# Altium schematic sheet develboard.SchDoc
size A3; License: GPLv3; Hw_rev: 0; Address3: Firenze; Address4: ITALY; DocumentNumber: 3; Revision: 0; SheetNumber: 3; SheetTotal: 8
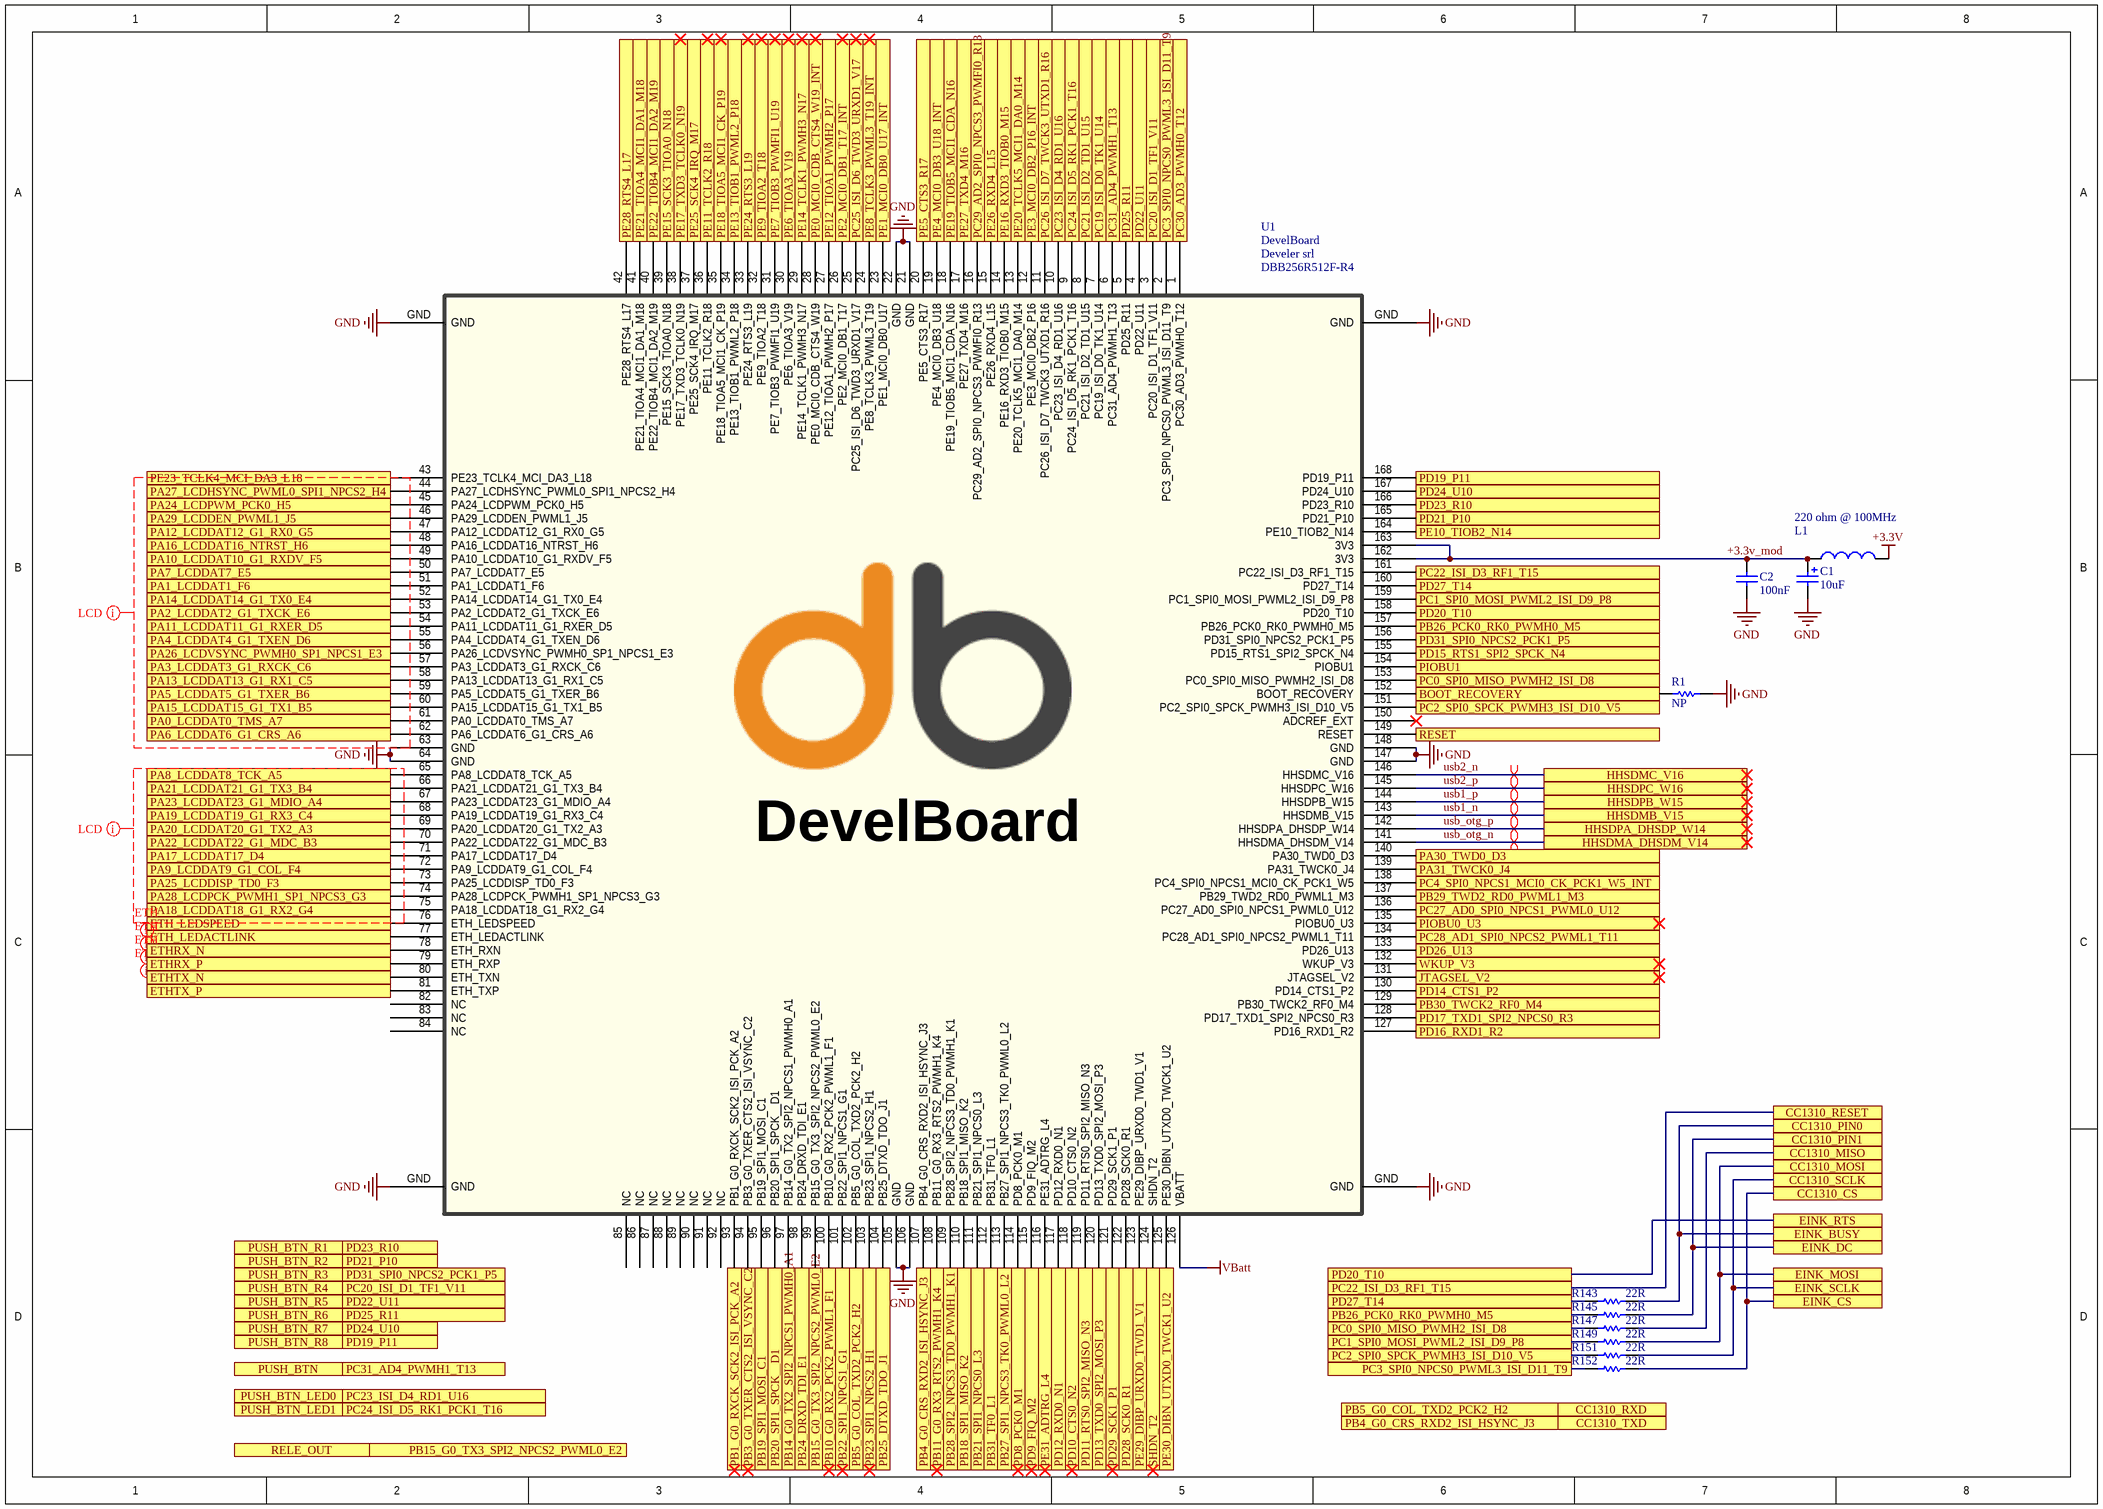
[diagram p0: develboard.SchDoc]

## Parts
C1  10uF  [1206_[3216]]
C2  100nF  [0603_[1608]]
L1  220 ohm @ 100MHz  [0805_[2012]]
R1  NP  [0603_[1608]]
R143  22R  [0603_[1608]]
R145  22R  [0603_[1608]]
R147  22R  [0603_[1608]]
R149  22R  [0603_[1608]]
R151  22R  [0603_[1608]]
R152  22R  [0603_[1608]]
U1  DevelBoard  Company: Develer srl  Order Code: DBB256R512F-R4  [develboard_footprint]

## Ports
BOOT_RECOVERY, CC1310_CS, CC1310_MISO, CC1310_MOSI, CC1310_PIN0, CC1310_PIN1, CC1310_RESET, CC1310_RXD, CC1310_SCLK, CC1310_TXD, EINK_BUSY, EINK_CS, EINK_DC, EINK_MOSI, EINK_RTS, EINK_SCLK, ETH_LEDACTLINK, ETH_LEDSPEED, ETHRX_N, ETHRX_P, ETHTX_N, ETHTX_P, HHSDMA_DHSDM_V14, HHSDMB_V15, HHSDMC_V16, HHSDPA_DHSDP_W14, HHSDPB_W15, HHSDPC_W16, JTAGSEL_V2, PA0_LCDDAT0_TMS_A7, PA1_LCDDAT1_F6, PA2_LCDDAT2_G1_TXCK_E6, PA3_LCDDAT3_G1_RXCK_C6, PA4_LCDDAT4_G1_TXEN_D6, PA5_LCDDAT5_G1_TXER_B6, PA6_LCDDAT6_G1_CRS_A6, PA7_LCDDAT7_E5, PA8_LCDDAT8_TCK_A5, PA9_LCDDAT9_G1_COL_F4, PA10_LCDDAT10_G1_RXDV_F5, PA11_LCDDAT11_G1_RXER_D5, PA12_LCDDAT12_G1_RX0_G5, PA13_LCDDAT13_G1_RX1_C5, PA14_LCDDAT14_G1_TX0_E4, PA15_LCDDAT15_G1_TX1_B5, PA16_LCDDAT16_NTRST_H6, PA17_LCDDAT17_D4, PA18_LCDDAT18_G1_RX2_G4, PA19_LCDDAT19_G1_RX3_C4, PA20_LCDDAT20_G1_TX2_A3, PA21_LCDDAT21_G1_TX3_B4, PA22_LCDDAT22_G1_MDC_B3, PA23_LCDDAT23_G1_MDIO_A4, PA24_LCDPWM_PCK0_H5, PA25_LCDDISP_TD0_F3, PA26_LCDVSYNC_PWMH0_SP1_NPCS1_E3, PA27_LCDHSYNC_PWML0_SPI1_NPCS2_H4, PA28_LCDPCK_PWMH1_SP1_NPCS3_G3, PA29_LCDDEN_PWML1_J5, PA30_TWD0_D3, PA31_TWCK0_J4, PB1_G0_RXCK_SCK2_ISI_PCK_A2, PB3_G0_TXER_CTS2_ISI_VSYNC_C2, PB4_G0_CRS_RXD2_ISI_HSYNC_J3, PB5_G0_COL_TXD2_PCK2_H2, PB10_G0_RX2_PCK2_PWML1_F1, PB11_G0_RX3_RTS2_PWMH1_K4, PB14_G0_TX2_SPI2_NPCS1_PWMH0_A1, PB15_G0_TX3_SPI2_NPCS2_PWML0_E2, PB18_SPI1_MISO_K2, PB19_SPI1_MOSI_C1, PB20_SPI1_SPCK__D1, PB21_SPI1_NPCS0_L3, PB22_SPI1_NPCS1_G1, PB23_SPI1_NPCS2_H1, PB24_DRXD_TDI_E1, PB25_DTXD_TDO_J1, PB26_PCK0_RK0_PWMH0_M5, PB27_SPI1_NPCS3_TK0_PWML0_L2, PB28_SPI2_NPCS3_TD0_PWMH1_K1, PB29_TWD2_RD0_PWML1_M3, PB30_TWCK2_RF0_M4, PB31_TF0_L1, PC0_SPI0_MISO_PWMH2_ISI_D8, PC1_SPI0_MOSI_PWML2_ISI_D9_P8, PC2_SPI0_SPCK_PWMH3_ISI_D10_V5, PC3_SPI0_NPCS0_PWML3_ISI_D11_T9, PC4_SPI0_NPCS1_MCI0_CK_PCK1_W5_INT, PC19_ISI_D0_TK1_U14, PC20_ISI_D1_TF1_V11, PC21_ISI_D2_TD1_U15, PC22_ISI_D3_RF1_T15, PC23_ISI_D4_RD1_U16, PC24_ISI_D5_RK1_PCK1_T16, PC25_ISI_D6_TWD3_URXD1_V17, PC26_ISI_D7_TWCK3_UTXD1_R16, PC27_AD0_SPI0_NPCS1_PWML0_U12, PC28_AD1_SPI0_NPCS2_PWML1_T11, PC29_AD2_SPI0_NPCS3_PWMFI0_R13, PC30_AD3_PWMH0_T12, PC31_AD4_PWMH1_T13, PD8_PCK0_M1, PD9_FIQ_M2, PD10_CTS0_N2, PD11_RTS0_SPI2_MISO_N3, PD12_RXD0_N1, PD13_TXD0_SPI2_MOSI_P3, PD14_CTS1_P2, PD15_RTS1_SPI2_SPCK_N4, PD16_RXD1_R2, PD17_TXD1_SPI2_NPCS0_R3, PD19_P11, PD20_T10, PD21_P10, PD22_U11, PD23_R10, PD24_U10, PD25_R11, PD26_U13, PD27_T14, PD28_SCK0_R1, PD29_SCK1_P1, PD31_SPI0_NPCS2_PCK1_P5, PE0_MCI0_CDB_CTS4_W19_INT, PE1_MCI0_DB0_U17_INT, PE2_MCI0_DB1_T17_INT, PE3_MCI0_DB2_P16_INT, PE4_MCI0_DB3_U18_INT, PE5_CTS3_R17, PE6_TIOA3_V19, PE7_TIOB3_PWMFI1_U19, PE8_TCLK3_PWML3_T19_INT, PE9_TIOA2_T18, PE10_TIOB2_N14, PE11_TCLK2_R18, PE12_TIOA1_PWMH2_P17, PE13_TIOB1_PWML2_P18, PE14_TCLK1_PWMH3_N17, PE15_SCK3_TIOA0_N18, PE16_RXD3_TIOB0_M15, PE17_TXD3_TCLK0_N19, PE18_TIOA5_MCI1_CK_P19, PE19_TIOB5_MCI1_CDA_N16, PE20_TCLK5_MCI1_DA0_M14, PE21_TIOA4_MCI1_DA1_M18, PE22_TIOB4_MCI1_DA2_M19, PE23_TCLK4_MCI_DA3_L18, PE24_RTS3_L19, PE25_SCK4_IRQ_M17, PE26_RXD4_L15, PE27_TXD4_M16, PE28_RTS4_L17, PE29_DIBP_URXD0_TWD1_V1, PE30_DIBN_UTXD0_TWCK1_U2, PE31_ADTRG_L4, PIOBU0_U3, PIOBU1, PUSH_BTN, PUSH_BTN_LED0, PUSH_BTN_LED1, PUSH_BTN_R1, PUSH_BTN_R2, PUSH_BTN_R3, PUSH_BTN_R4, PUSH_BTN_R5, PUSH_BTN_R6, PUSH_BTN_R7, PUSH_BTN_R8, RELE_OUT, RESET, SHDN_T2, WKUP_V3

## Nets
+3.3V: L1.1
GND: C1.2 C2.2 R1.1 U1.21(GND) U1.22(GND) U1.63(GND) U1.64(GND) U1.105(GND) U1.106(GND) U1.147(GND) U1.148(GND) U1.GND
VBatt: U1.126(VBATT)
+3.3v_mod: C1.1 C2.1 L1.2 U1.162(3V3) U1.163(3V3)
BOOT_RECOVERY: R1.2 U1.152(BOOT_RECOVERY) ; port BOOT_RECOVERY
CC1310_CS: R152.1 ; port CC1310_CS, port EINK_CS
CC1310_MISO: R147.1 ; port CC1310_MISO
CC1310_MOSI: R149.1 ; port CC1310_MOSI, port EINK_MOSI
CC1310_PIN0: R143.1 ; port CC1310_PIN0, port EINK_BUSY
CC1310_PIN1: R145.1 ; port CC1310_PIN1, port EINK_DC
CC1310_RESET: U1.161(PC22_ISI_D3_RF1_T15) ; port PC22_ISI_D3_RF1_T15, port CC1310_RESET
CC1310_RXD: U1.102(PB5_G0_COL_TXD2_PCK2_H2) ; port PB5_G0_COL_TXD2_PCK2_H2, port CC1310_RXD
CC1310_SCLK: R151.1 ; port CC1310_SCLK, port EINK_SCLK
CC1310_TXD: U1.107(PB4_G0_CRS_RXD2_ISI_HSYNC_J3) ; port PB4_G0_CRS_RXD2_ISI_HSYNC_J3, port CC1310_TXD
EINK_RTS: U1.158(PD20_T10) ; port PD20_T10, port EINK_RTS
ETH_LEDACTLINK: U1.77(ETH_LEDACTLINK) ; port ETH_LEDACTLINK
ETH_LEDSPEED: U1.76(ETH_LEDSPEED) ; port ETH_LEDSPEED
ETHRX_N: U1.78(ETH_RXN) ; port ETHRX_N
ETHRX_P: U1.79(ETH_RXP) ; port ETHRX_P
ETHTX_N: U1.80(ETH_TXN) ; port ETHTX_N
ETHTX_P: U1.81(ETH_TXP) ; port ETHTX_P
JTAGSEL_V2: U1.131(JTAGSEL_V2) ; port JTAGSEL_V2
PA0_LCDDAT0_TMS_A7: U1.61(PA0_LCDDAT0_TMS_A7) ; port PA0_LCDDAT0_TMS_A7
PA1_LCDDAT1_F6: U1.51(PA1_LCDDAT1_F6) ; port PA1_LCDDAT1_F6
PA2_LCDDAT2_G1_TXCK_E6: U1.53(PA2_LCDDAT2_G1_TXCK_E6) ; port PA2_LCDDAT2_G1_TXCK_E6
PA3_LCDDAT3_G1_RXCK_C6: U1.57(PA3_LCDDAT3_G1_RXCK_C6) ; port PA3_LCDDAT3_G1_RXCK_C6
PA4_LCDDAT4_G1_TXEN_D6: U1.55(PA4_LCDDAT4_G1_TXEN_D6) ; port PA4_LCDDAT4_G1_TXEN_D6
PA5_LCDDAT5_G1_TXER_B6: U1.59(PA5_LCDDAT5_G1_TXER_B6) ; port PA5_LCDDAT5_G1_TXER_B6
PA6_LCDDAT6_G1_CRS_A6: U1.62(PA6_LCDDAT6_G1_CRS_A6) ; port PA6_LCDDAT6_G1_CRS_A6
PA7_LCDDAT7_E5: U1.50(PA7_LCDDAT7_E5) ; port PA7_LCDDAT7_E5
PA8_LCDDAT8_TCK_A5: U1.65(PA8_LCDDAT8_TCK_A5) ; port PA8_LCDDAT8_TCK_A5
PA9_LCDDAT9_G1_COL_F4: U1.72(PA9_LCDDAT9_G1_COL_F4) ; port PA9_LCDDAT9_G1_COL_F4
PA10_LCDDAT10_G1_RXDV_F5: U1.49(PA10_LCDDAT10_G1_RXDV_F5) ; port PA10_LCDDAT10_G1_RXDV_F5
PA11_LCDDAT11_G1_RXER_D5: U1.54(PA11_LCDDAT11_G1_RXER_D5) ; port PA11_LCDDAT11_G1_RXER_D5
PA12_LCDDAT12_G1_RX0_G5: U1.47(PA12_LCDDAT12_G1_RX0_G5) ; port PA12_LCDDAT12_G1_RX0_G5
PA13_LCDDAT13_G1_RX1_C5: U1.58(PA13_LCDDAT13_G1_RX1_C5) ; port PA13_LCDDAT13_G1_RX1_C5
PA14_LCDDAT14_G1_TX0_E4: U1.52(PA14_LCDDAT14_G1_TX0_E4) ; port PA14_LCDDAT14_G1_TX0_E4
PA15_LCDDAT15_G1_TX1_B5: U1.60(PA15_LCDDAT15_G1_TX1_B5) ; port PA15_LCDDAT15_G1_TX1_B5
PA16_LCDDAT16_NTRST_H6: U1.48(PA16_LCDDAT16_NTRST_H6) ; port PA16_LCDDAT16_NTRST_H6
PA17_LCDDAT17_D4: U1.71(PA17_LCDDAT17_D4) ; port PA17_LCDDAT17_D4
PA18_LCDDAT18_G1_RX2_G4: U1.75(PA18_LCDDAT18_G1_RX2_G4) ; port PA18_LCDDAT18_G1_RX2_G4
PA19_LCDDAT19_G1_RX3_C4: U1.68(PA19_LCDDAT19_G1_RX3_C4) ; port PA19_LCDDAT19_G1_RX3_C4
PA20_LCDDAT20_G1_TX2_A3: U1.69(PA20_LCDDAT20_G1_TX2_A3) ; port PA20_LCDDAT20_G1_TX2_A3
PA21_LCDDAT21_G1_TX3_B4: U1.66(PA21_LCDDAT21_G1_TX3_B4) ; port PA21_LCDDAT21_G1_TX3_B4
PA22_LCDDAT22_G1_MDC_B3: U1.70(PA22_LCDDAT22_G1_MDC_B3) ; port PA22_LCDDAT22_G1_MDC_B3
PA23_LCDDAT23_G1_MDIO_A4: U1.67(PA23_LCDDAT23_G1_MDIO_A4) ; port PA23_LCDDAT23_G1_MDIO_A4
PA24_LCDPWM_PCK0_H5: U1.45(PA24_LCDPWM_PCK0_H5) ; port PA24_LCDPWM_PCK0_H5
PA25_LCDDISP_TD0_F3: U1.73(PA25_LCDDISP_TD0_F3) ; port PA25_LCDDISP_TD0_F3
PA26_LCDVSYNC_PWMH0_SP1_NPCS1_E3: U1.56(PA26_LCDVSYNC_PWMH0_SP1_NPCS1_E3) ; port PA26_LCDVSYNC_PWMH0_SP1_NPCS1_E3
PA27_LCDHSYNC_PWML0_SPI1_NPCS2_H4: U1.44(PA27_LCDHSYNC_PWML0_SPI1_NPCS2_H4) ; port PA27_LCDHSYNC_PWML0_SPI1_NPCS2_H4
PA28_LCDPCK_PWMH1_SP1_NPCS3_G3: U1.74(PA28_LCDPCK_PWMH1_SP1_NPCS3_G3) ; port PA28_LCDPCK_PWMH1_SP1_NPCS3_G3
PA29_LCDDEN_PWML1_J5: U1.46(PA29_LCDDEN_PWML1_J5) ; port PA29_LCDDEN_PWML1_J5
PA30_TWD0_D3: U1.140(PA30_TWD0_D3) ; port PA30_TWD0_D3
PA31_TWCK0_J4: U1.139(PA31_TWCK0_J4) ; port PA31_TWCK0_J4
PB1_G0_RXCK_SCK2_ISI_PCK_A2: U1.93(PB1_G0_RXCK_SCK2_ISI_PCK_A2) ; port PB1_G0_RXCK_SCK2_ISI_PCK_A2
PB3_G0_TXER_CTS2_ISI_VSYNC_C2: U1.94(PB3_G0_TXER_CTS2_ISI_VSYNC_C2) ; port PB3_G0_TXER_CTS2_ISI_VSYNC_C2
PB10_G0_RX2_PCK2_PWML1_F1: U1.100(PB10_G0_RX2_PCK2_PWML1_F1) ; port PB10_G0_RX2_PCK2_PWML1_F1
PB11_G0_RX3_RTS2_PWMH1_K4: U1.108(PB11_G0_RX3_RTS2_PWMH1_K4) ; port PB11_G0_RX3_RTS2_PWMH1_K4
PB14_G0_TX2_SPI2_NPCS1_PWMH0_A1: U1.97(PB14_G0_TX2_SPI2_NPCS1_PWMH0_A1) ; port PB14_G0_TX2_SPI2_NPCS1_PWMH0_A1
PB15_G0_TX3_SPI2_NPCS2_PWML0_E2: U1.99(PB15_G0_TX3_SPI2_NPCS2_PWML0_E2) ; port PB15_G0_TX3_SPI2_NPCS2_PWML0_E2, port RELE_OUT
PB18_SPI1_MISO_K2: U1.110(PB18_SPI1_MISO_K2) ; port PB18_SPI1_MISO_K2
PB19_SPI1_MOSI_C1: U1.95(PB19_SPI1_MOSI_C1) ; port PB19_SPI1_MOSI_C1
PB20_SPI1_SPCK__D1: U1.96(PB20_SPI1_SPCK__D1) ; port PB20_SPI1_SPCK__D1
PB21_SPI1_NPCS0_L3: U1.111(PB21_SPI1_NPCS0_L3) ; port PB21_SPI1_NPCS0_L3
PB22_SPI1_NPCS1_G1: U1.101(PB22_SPI1_NPCS1_G1) ; port PB22_SPI1_NPCS1_G1
PB23_SPI1_NPCS2_H1: U1.103(PB23_SPI1_NPCS2_H1) ; port PB23_SPI1_NPCS2_H1
PB24_DRXD_TDI_E1: U1.98(PB24_DRXD_TDI_E1) ; port PB24_DRXD_TDI_E1
PB25_DTXD_TDO_J1: U1.104(PB25_DTXD_TDO_J1) ; port PB25_DTXD_TDO_J1
PB26_PCK0_RK0_PWMH0_M5: R145.2 U1.157(PB26_PCK0_RK0_PWMH0_M5) ; port PB26_PCK0_RK0_PWMH0_M5
PB27_SPI1_NPCS3_TK0_PWML0_L2: U1.113(PB27_SPI1_NPCS3_TK0_PWML0_L2) ; port PB27_SPI1_NPCS3_TK0_PWML0_L2
PB28_SPI2_NPCS3_TD0_PWMH1_K1: U1.109(PB28_SPI2_NPCS3_TD0_PWMH1_K1) ; port PB28_SPI2_NPCS3_TD0_PWMH1_K1
PB29_TWD2_RD0_PWML1_M3: U1.137(PB29_TWD2_RD0_PWML1_M3) ; port PB29_TWD2_RD0_PWML1_M3
PB30_TWCK2_RF0_M4: U1.129(PB30_TWCK2_RF0_M4) ; port PB30_TWCK2_RF0_M4
PB31_TF0_L1: U1.112(PB31_TF0_L1) ; port PB31_TF0_L1
PC0_SPI0_MISO_PWMH2_ISI_D8: R147.2 U1.153(PC0_SPI0_MISO_PWMH2_ISI_D8) ; port PC0_SPI0_MISO_PWMH2_ISI_D8
PC1_SPI0_MOSI_PWML2_ISI_D9_P8: R149.2 U1.159(PC1_SPI0_MOSI_PWML2_ISI_D9_P8) ; port PC1_SPI0_MOSI_PWML2_ISI_D9_P8
PC2_SPI0_SPCK_PWMH3_ISI_D10_V5: R151.2 U1.151(PC2_SPI0_SPCK_PWMH3_ISI_D10_V5) ; port PC2_SPI0_SPCK_PWMH3_ISI_D10_V5
PC3_SPI0_NPCS0_PWML3_ISI_D11_T9: R152.2 U1.2(PC3_SPI0_NPCS0_PWML3_ISI_D11_T9) ; port PC3_SPI0_NPCS0_PWML3_ISI_D11_T9
PC4_SPI0_NPCS1_MCI0_CK_PCK1_W5_INT: U1.138(PC4_SPI0_NPCS1_MCI0_CK_PCK1_W5) ; port PC4_SPI0_NPCS1_MCI0_CK_PCK1_W5_INT
PC19_ISI_D0_TK1_U14: U1.7(PC19_ISI_D0_TK1_U14) ; port PC19_ISI_D0_TK1_U14
PC20_ISI_D1_TF1_V11: U1.3(PC20_ISI_D1_TF1_V11) ; port PC20_ISI_D1_TF1_V11, port PUSH_BTN_R4
PC21_ISI_D2_TD1_U15: U1.8(PC21_ISI_D2_TD1_U15) ; port PC21_ISI_D2_TD1_U15
PC23_ISI_D4_RD1_U16: U1.10(PC23_ISI_D4_RD1_U16) ; port PC23_ISI_D4_RD1_U16, port PUSH_BTN_LED0
PC24_ISI_D5_RK1_PCK1_T16: U1.9(PC24_ISI_D5_RK1_PCK1_T16) ; port PC24_ISI_D5_RK1_PCK1_T16, port PUSH_BTN_LED1
PC25_ISI_D6_TWD3_URXD1_V17: U1.25(PC25_ISI_D6_TWD3_URXD1_V17) ; port PC25_ISI_D6_TWD3_URXD1_V17
PC26_ISI_D7_TWCK3_UTXD1_R16: U1.11(PC26_ISI_D7_TWCK3_UTXD1_R16) ; port PC26_ISI_D7_TWCK3_UTXD1_R16
PC27_AD0_SPI0_NPCS1_PWML0_U12: U1.136(PC27_AD0_SPI0_NPCS1_PWML0_U12) ; port PC27_AD0_SPI0_NPCS1_PWML0_U12
PC28_AD1_SPI0_NPCS2_PWML1_T11: U1.134(PC28_AD1_SPI0_NPCS2_PWML1_T11) ; port PC28_AD1_SPI0_NPCS2_PWML1_T11
PC29_AD2_SPI0_NPCS3_PWMFI0_R13: U1.16(PC29_AD2_SPI0_NPCS3_PWMFI0_R13) ; port PC29_AD2_SPI0_NPCS3_PWMFI0_R13
PC30_AD3_PWMH0_T12: U1.1(PC30_AD3_PWMH0_T12) ; port PC30_AD3_PWMH0_T12
PC31_AD4_PWMH1_T13: U1.6(PC31_AD4_PWMH1_T13) ; port PC31_AD4_PWMH1_T13, port PUSH_BTN
PD8_PCK0_M1: U1.114(PD8_PCK0_M1) ; port PD8_PCK0_M1
PD9_FIQ_M2: U1.115(PD9_FIQ_M2) ; port PD9_FIQ_M2
PD10_CTS0_N2: U1.118(PD10_CTS0_N2) ; port PD10_CTS0_N2
PD11_RTS0_SPI2_MISO_N3: U1.119(PD11_RTS0_SPI2_MISO_N3) ; port PD11_RTS0_SPI2_MISO_N3
PD12_RXD0_N1: U1.117(PD12_RXD0_N1) ; port PD12_RXD0_N1
PD13_TXD0_SPI2_MOSI_P3: U1.120(PD13_TXD0_SPI2_MOSI_P3) ; port PD13_TXD0_SPI2_MOSI_P3
PD14_CTS1_P2: U1.130(PD14_CTS1_P2) ; port PD14_CTS1_P2
PD15_RTS1_SPI2_SPCK_N4: U1.155(PD15_RTS1_SPI2_SPCK_N4) ; port PD15_RTS1_SPI2_SPCK_N4
PD16_RXD1_R2: U1.127(PD16_RXD1_R2) ; port PD16_RXD1_R2
PD17_TXD1_SPI2_NPCS0_R3: U1.128(PD17_TXD1_SPI2_NPCS0_R3) ; port PD17_TXD1_SPI2_NPCS0_R3
PD19_P11: U1.168(PD19_P11) ; port PD19_P11, port PUSH_BTN_R8
PD21_P10: U1.165(PD21_P10) ; port PD21_P10, port PUSH_BTN_R2
PD22_U11: U1.4(PD22_U11) ; port PD22_U11, port PUSH_BTN_R5
PD23_R10: U1.166(PD23_R10) ; port PD23_R10, port PUSH_BTN_R1
PD24_U10: U1.167(PD24_U10) ; port PD24_U10, port PUSH_BTN_R7
PD25_R11: U1.5(PD25_R11) ; port PD25_R11, port PUSH_BTN_R6
PD26_U13: U1.133(PD26_U13) ; port PD26_U13
PD27_T14: R143.2 U1.160(PD27_T14) ; port PD27_T14
PD28_SCK0_R1: U1.122(PD28_SCK0_R1) ; port PD28_SCK0_R1
PD29_SCK1_P1: U1.121(PD29_SCK1_P1) ; port PD29_SCK1_P1
PD31_SPI0_NPCS2_PCK1_P5: U1.156(PD31_SPI0_NPCS2_PCK1_P5) ; port PD31_SPI0_NPCS2_PCK1_P5, port PUSH_BTN_R3
PE0_MCI0_CDB_CTS4_W19_INT: U1.28(PE0_MCI0_CDB_CTS4_W19) ; port PE0_MCI0_CDB_CTS4_W19_INT
PE1_MCI0_DB0_U17_INT: U1.23(PE1_MCI0_DB0_U17) ; port PE1_MCI0_DB0_U17_INT
PE2_MCI0_DB1_T17_INT: U1.26(PE2_MCI0_DB1_T17) ; port PE2_MCI0_DB1_T17_INT
PE3_MCI0_DB2_P16_INT: U1.12(PE3_MCI0_DB2_P16) ; port PE3_MCI0_DB2_P16_INT
PE4_MCI0_DB3_U18_INT: U1.19(PE4_MCI0_DB3_U18) ; port PE4_MCI0_DB3_U18_INT
PE5_CTS3_R17: U1.20(PE5_CTS3_R17) ; port PE5_CTS3_R17
PE6_TIOA3_V19: U1.30(PE6_TIOA3_V19) ; port PE6_TIOA3_V19
PE7_TIOB3_PWMFI1_U19: U1.31(PE7_TIOB3_PWMFI1_U19) ; port PE7_TIOB3_PWMFI1_U19
PE8_TCLK3_PWML3_T19_INT: U1.24(PE8_TCLK3_PWML3_T19) ; port PE8_TCLK3_PWML3_T19_INT
PE9_TIOA2_T18: U1.32(PE9_TIOA2_T18) ; port PE9_TIOA2_T18
PE10_TIOB2_N14: U1.164(PE10_TIOB2_N14) ; port PE10_TIOB2_N14
PE11_TCLK2_R18: U1.36(PE11_TCLK2_R18) ; port PE11_TCLK2_R18
PE12_TIOA1_PWMH2_P17: U1.27(PE12_TIOA1_PWMH2_P17) ; port PE12_TIOA1_PWMH2_P17
PE13_TIOB1_PWML2_P18: U1.34(PE13_TIOB1_PWML2_P18) ; port PE13_TIOB1_PWML2_P18
PE14_TCLK1_PWMH3_N17: U1.29(PE14_TCLK1_PWMH3_N17) ; port PE14_TCLK1_PWMH3_N17
PE15_SCK3_TIOA0_N18: U1.39(PE15_SCK3_TIOA0_N18) ; port PE15_SCK3_TIOA0_N18
PE16_RXD3_TIOB0_M15: U1.14(PE16_RXD3_TIOB0_M15) ; port PE16_RXD3_TIOB0_M15
PE17_TXD3_TCLK0_N19: U1.38(PE17_TXD3_TCLK0_N19) ; port PE17_TXD3_TCLK0_N19
PE18_TIOA5_MCI1_CK_P19: U1.35(PE18_TIOA5_MCI1_CK_P19) ; port PE18_TIOA5_MCI1_CK_P19
PE19_TIOB5_MCI1_CDA_N16: U1.18(PE19_TIOB5_MCI1_CDA_N16) ; port PE19_TIOB5_MCI1_CDA_N16
PE20_TCLK5_MCI1_DA0_M14: U1.13(PE20_TCLK5_MCI1_DA0_M14) ; port PE20_TCLK5_MCI1_DA0_M14
PE21_TIOA4_MCI1_DA1_M18: U1.41(PE21_TIOA4_MCI1_DA1_M18) ; port PE21_TIOA4_MCI1_DA1_M18
PE22_TIOB4_MCI1_DA2_M19: U1.40(PE22_TIOB4_MCI1_DA2_M19) ; port PE22_TIOB4_MCI1_DA2_M19
PE23_TCLK4_MCI_DA3_L18: U1.43(PE23_TCLK4_MCI_DA3_L18) ; port PE23_TCLK4_MCI_DA3_L18
PE24_RTS3_L19: U1.33(PE24_RTS3_L19) ; port PE24_RTS3_L19
PE25_SCK4_IRQ_M17: U1.37(PE25_SCK4_IRQ_M17) ; port PE25_SCK4_IRQ_M17
PE26_RXD4_L15: U1.15(PE26_RXD4_L15) ; port PE26_RXD4_L15
PE27_TXD4_M16: U1.17(PE27_TXD4_M16) ; port PE27_TXD4_M16
PE28_RTS4_L17: U1.42(PE28_RTS4_L17) ; port PE28_RTS4_L17
PE29_DIBP_URXD0_TWD1_V1: U1.123(PE29_DIBP_URXD0_TWD1_V1) ; port PE29_DIBP_URXD0_TWD1_V1
PE30_DIBN_UTXD0_TWCK1_U2: U1.125(PE30_DIBN_UTXD0_TWCK1_U2) ; port PE30_DIBN_UTXD0_TWCK1_U2
PE31_ADTRG_L4: U1.116(PE31_ADTRG_L4) ; port PE31_ADTRG_L4
PIOBU0_U3: U1.135(PIOBU0_U3) ; port PIOBU0_U3
PIOBU1: U1.154(PIOBU1) ; port PIOBU1
RESET: U1.149(RESET) ; port RESET
SHDN_T2: U1.124(SHDN_T2) ; port SHDN_T2
usb1_n: U1.143(HHSDMB_V15) ; port HHSDMB_V15
usb1_p: U1.144(HHSDPB_W15) ; port HHSDPB_W15
usb2_n: U1.146(HHSDMC_V16) ; port HHSDMC_V16
usb2_p: U1.145(HHSDPC_W16) ; port HHSDPC_W16
usb_otg_n: U1.141(HHSDMA_DHSDM_V14) ; port HHSDMA_DHSDM_V14
usb_otg_p: U1.142(HHSDPA_DHSDP_W14) ; port HHSDPA_DHSDP_W14
WKUP_V3: U1.132(WKUP_V3) ; port WKUP_V3

Not connected (* = marked no-connect by the designer): U1 82(NC) 83(NC) 84(NC) 85(NC) 86(NC) 87(NC) 88(NC) 89(NC) 90(NC) 91(NC) 92(NC) 150(ADCREF_EXT)*

## Layout directives
differential pair: ETHRX_N, ETHRX_P, ETHTX_N, ETHTX_P, usb1_n, usb1_p, usb2_n, usb2_p, usb_otg_n, usb_otg_p
net class LCD: (no net found under the mark)

## Library data of the parts
C1 = Cap Pol1: Ceramic X5R 25V; Published: 8-Jun-2000; Revision: July-2002: Re-released for DXP Platform.; Publisher: Altium Limited; Value: 10uF
C2 = Cap: Ceramic X7R 50V; Value: 100pF; Published: 8-Jun-2000; LatestRevisionDate: 17-Jul-2002; LatestRevisionNote: Re-released for DXP Platform.; PackageReference: RAD-0.3; Publisher: Altium Limited; PackageDescription: Radial Cap, Thru-Hole; 2 Leads; 0.3 in Pin Spacing
L1 = Inductor: WE 742792022
R1 = Res1: Resistor; Revision: July-2002: Re-released for DXP Platform.
R143 R145 R147 R149 R151 R152 = Res1: Resistor; Value: 1K; Published: 8-Jun-2000; Revision: July-2002: Re-released for DXP Platform.; Publisher: Altium Limited
U1 = develboard_pinout: Faster Little Linux Module; Symbol version: rev.0; Publish date: 26/10/2015; Family: BLUE